# Altium schematic sheet Power.SchDoc
size A4; SheetNumber: 4; SheetTotal: 5
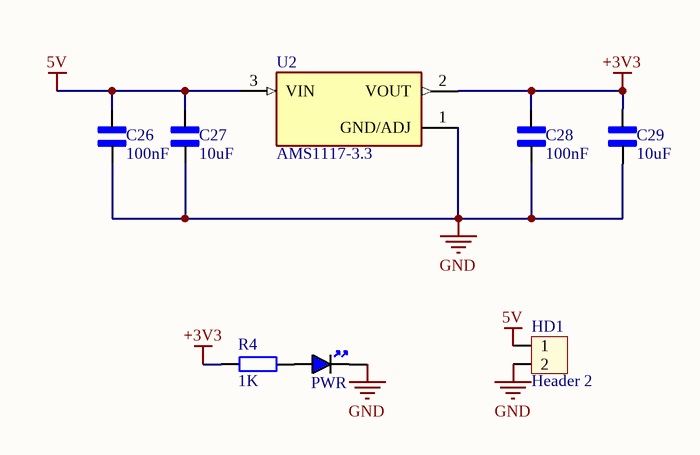
[diagram p0: Power.SchDoc]

## Parts
C26  100nF  [CAPC2012X145N]
C27  10uF  [CAPC2012X145N]
C28  100nF  [CAPC2012X145N]
C29  10uF  [CAPC2012X145N]
HD1  Header 2  [HED2]
PWR  BLUE  [LED_0805_BLUE]  (value not drawn)
R4  1K  [SM-0805]
U2  AMS1117-3.3  [SOT229P700X180-4N]

## Nets
5V: C26.2 C27.2 HD1.1 U2.3(VIN)
+3V3: C28.2 C29.2 R4.1 U2.2(VOUT)
GND: C26.1 C27.1 C28.1 C29.1 HD1.2 PWR.K U2.1(GND/ADJ)
NetPWR_A: PWR.A R4.2

## Library data of the parts
C26-C29 = VJ0805A390GXCAP: 39 pF Â±2% 200V Ceramic Capacitor C0G, NP0 0805 (2012 Metric); MF: Vishay Vitramon; SnapEDA_Link: https://www.snapeda.com/parts/VJ0805A390GXCAP/Vishay/view-part/?ref=snap; Package: 2012 Vishay Vitramon; Value: *; MP: VJ0805A390GXCAP; Check_prices: https://www.snapeda.com/parts/VJ0805A390GXCAP/Vishay/view-part/?ref=eda
HD1 = Hed2: Header 2 (Green); Value: Header 2
PWR = LED_0805_BLUE: LED 0805 BLUE SMD; Manufacturer: *; Manufacturer Part Number: *; Distributor Link: *; LCSC: *
R4 = RM: Resistor SMD; Value: 1K
U2 = AMS1117-3.3: Sot223/Pkg 1-Amp 3.3-Volt Low Drop Out Voltage Regulatator; MF: Advanced Monolithic Systems; SnapEDA_Link: https://www.snapeda.com/parts/AMS1117-3.3/Advanced+Monolithic+Systems/view-part/?ref=snap; Package: SOT-223 Seeed Technology; Value: *; MP: AMS1117-3.3; Check_prices: https://www.snapeda.com/parts/AMS1117-3.3/Advanced+Monolithic+Systems/view-part/?ref=eda